# Altium schematic sheet Sheet1.SchDoc
size 420 x 297 mm; Date: 29.07.2026; Address1: Address1; Address2: Address2; Address3: Address3; Address4: Address4; SheetNumber: 1; Scale: 1:1; DocumentType: Схема электрическая принципиальная; FirstReferrence: АБВГ.123456.001
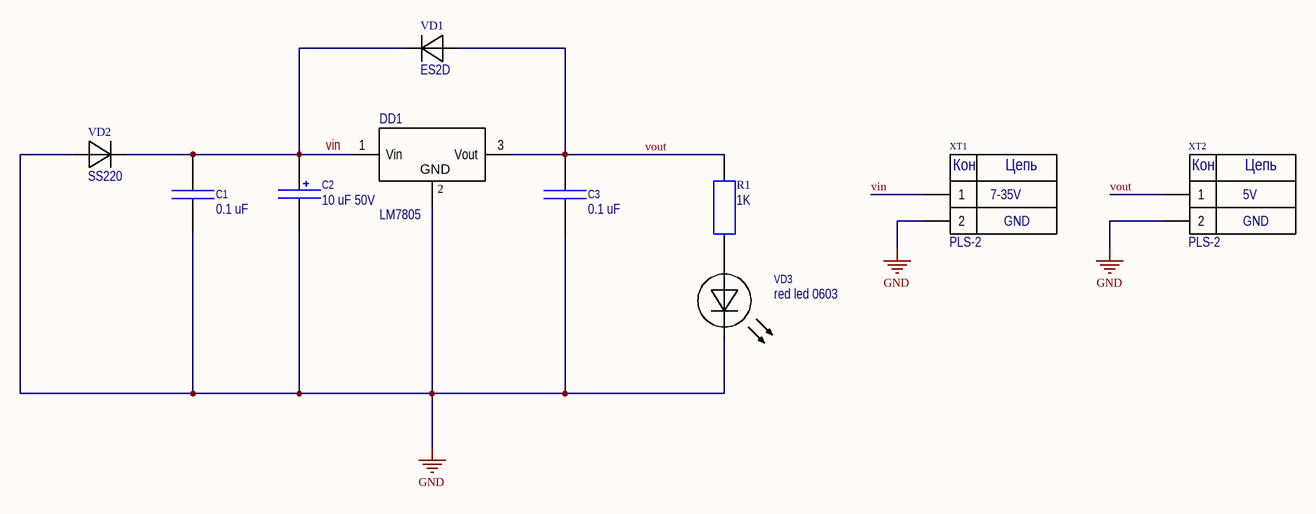
[diagram p0: Sheet1.SchDoc]

## Parts
C1  value 0.1 uF  [Cap_0603]  (hidden comment: Capacitor)
C2  value 10 uF 50V  [CapDip5S]  (hidden comment: Capacitor_Polar)
C3  value 0.1 uF  [Cap_0603]  (hidden comment: Capacitor)
DD1  Name: LM7805  [TO-220A-L]  (hidden comment: Стабилизатор)
R1  value 1K  [RES_0603]  (hidden comment: Resistor)
VD1  Name: ES2D  [SMB]  (hidden comment: Diode)
VD2  Name: SS220  [SMB]  (hidden comment: Diode)
VD3  value red led 0603  [LED 0603_1608 RED]  (hidden comment: LED)
XT1  value PLS-2  [PLS-2]  (hidden comment: Header 1x2)
XT2  value PLS-2  [PLS-2]  (hidden comment: Header 1x2)

## Nets
GND: C1.1 C2.2 C3.1 DD1.2(GND) VD2.1 VD3.2 XT1.2 XT2.2
vin: C1.2 C2.1 DD1.1(Vin) VD1.2 VD2.2 XT1.1
vout: C3.2 DD1.3(Vout) R1.2 VD1.1 XT2.1
NetR1_1: R1.1 VD3.1

## Notes on the sheet
- (near XT1) 7-35V
- (near XT1) GND
- (near XT2) 5V
- (near XT2) GND
- Подп. и дата
- Инв. № дубл.
- Взам. инв. №
- Инв. № подл.
- Изм.
- Лист
- № докум.
- Подп.
- Дата
- 2.106-A3
- Копировал
- Формат А3
- (in symbol Header 1x2) Кон; Цепь

## Library data of the parts
C1 C3 = Capacitor: Конденсатор; Package: 0805
C2 = Capacitor_Polar: Конденсатор эл-лит; Package: DIP
R1 = Resistor: Резистор; Package: 0805
VD1 VD2 = Diode: Диод
VD3 = LED: Светодиод; Package: DIP
XT1 XT2 = Header 1x2: Header 1x3; Name: Jamper
DD1 = Стабилизатор: Package: TO220